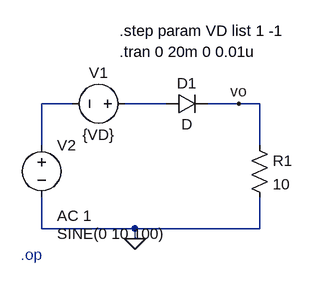
[diagram p0: schematic CNL-Diodo.asc]
CNL-Diodo.asc, the LTspice schematic file:
Version 4.1
SHEET 1 880 680
WIRE -832 128 -880 128
WIRE -688 128 -752 128
WIRE -576 128 -624 128
WIRE -544 128 -576 128
WIRE -880 192 -880 128
WIRE -544 192 -544 128
WIRE -880 320 -880 272
WIRE -736 320 -880 320
WIRE -544 320 -544 272
WIRE -544 320 -736 320
WIRE -736 336 -736 320
FLAG -736 336 0
FLAG -576 128 vo
SYMBOL voltage -736 128 R90
WINDOW 0 -32 56 VBottom 2
WINDOW 3 32 56 VTop 2
WINDOW 123 0 0 Left 0
WINDOW 39 0 0 Left 0
SYMATTR InstName V1
SYMATTR Value {VD}
SYMBOL res -560 176 R0
SYMATTR InstName R1
SYMATTR Value 10
SYMBOL voltage -880 176 R0
WINDOW 3 24 152 Left 2
WINDOW 123 24 124 Left 2
WINDOW 39 0 0 Left 0
SYMATTR InstName V2
SYMATTR Value SINE(0 10 100)
SYMATTR Value2 AC 1
SYMBOL diode -688 144 R270
WINDOW 0 32 32 VTop 2
WINDOW 3 0 32 VBottom 2
SYMATTR InstName D1
TEXT -912 360 Left 2 ;.op
TEXT -760 48 Left 2 !.tran 0 20m 0 0.01u
TEXT -760 16 Left 2 !.step param VD list 1 -1

The netlist it stands for:
* CNL-Diodo.asc
V1 N002 N001 {VD}
R1 vo 0 10
V2 N001 0 SINE(0 10 100) AC 1
D1 N002 vo D
.model D D
.lib standard.dio
* .op
.tran 0 20m 0 0.01u
.step param VD list 1 -1
.backanno
.end